# Altium project Design_Project_2.PrjPcb
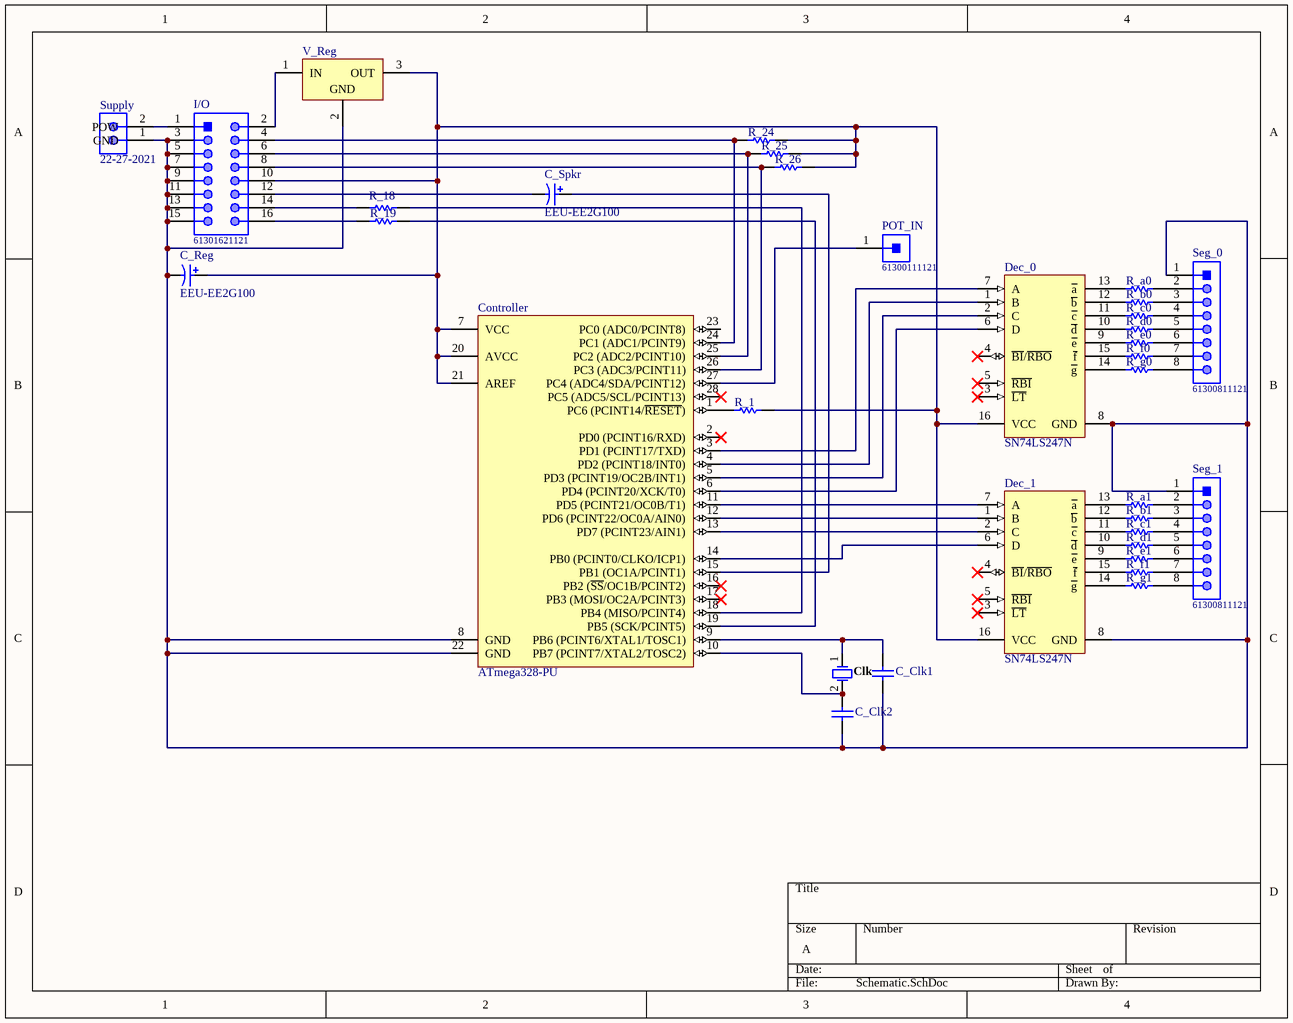
[diagram p0: Schematic.SchDoc]
1 sheet, 34 parts. Net scope: global (net labels, ports and power ports of the same name join across sheets).
Board file: PCB_Layout.PcbDoc

## Sheet Schematic.SchDoc
size A; SheetNumber: 1; SheetTotal: 1

### Parts
C_Clk1  C315C220K1G5TA  [KEMT-C315-THT-2]  (value not drawn)
C_Clk2  C315C220K1G5TA  [KEMT-C315-THT-2]  (value not drawn)
C_Reg  EEU-EE2G100  [PNSC-EEU-EE2G100-2_V]
C_Spkr  EEU-EE2G100  [PNSC-EEU-EE2G100-2_V]
Clk  FOXSLF/120-20  [FOX-FOXSLF-2_V]  (value not drawn)
Controller  ATmega328-PU  [28P3]
Dec_0  SN74LS247N  [N0016A]
Dec_1  SN74LS247N  [N0016A]
I/O  61301621121  [61301621121]
POT_IN  61300111121  [61300111121]
R_1  MFR-25FBF52-1K  [RESA60-630X240]  (value not drawn)
R_18  FR-25FF52-1K  [RESA60-630X240]  (value not drawn)
R_19  MFR-25FBF52-1K  [RESA60-630X240]  (value not drawn)
R_24  MFR-25FBF52-1K  [RESA60-630X240]  (value not drawn)
R_25  MFR-25FBF52-1K  [RESA60-630X240]  (value not drawn)
R_26  MFR-25FBF52-1K  [RESA60-630X240]  (value not drawn)
R_a0  MFR-25FBF52-1K  [RESA60-630X240]  (value not drawn)
R_a1  MFR-25FBF52-1K  [RESA60-630X240]  (value not drawn)
R_b0  MFR-25FBF52-1K  [RESA60-630X240]  (value not drawn)
R_b1  MFR-25FBF52-1K  [RESA60-630X240]  (value not drawn)
R_c0  MFR-25FBF52-1K  [RESA60-630X240]  (value not drawn)
R_c1  MFR-25FBF52-1K  [RESA60-630X240]  (value not drawn)
R_d0  MFR-25FBF52-1K  [RESA60-630X240]  (value not drawn)
R_d1  MFR-25FBF52-1K  [RESA60-630X240]  (value not drawn)
R_e0  MFR-25FBF52-1K  [RESA60-630X240]  (value not drawn)
R_e1  MFR-25FBF52-1K  [RESA60-630X240]  (value not drawn)
R_f0  MFR-25FBF52-1K  [RESA60-630X240]  (value not drawn)
R_f1  MFR-25FBF52-1K  [RESA60-630X240]  (value not drawn)
R_g0  MFR-25FBF52-1K  [RESA60-630X240]  (value not drawn)
R_g1  MFR-25FBF52-1K  [RESA60-630X240]  (value not drawn)
Seg_0  61300811121  [61300811121]
Seg_1  61300811121  [61300811121]
Supply  22-27-2021  [MOLX-22-27-2021_V]
V_Reg  LM7805CT  [FAIR-TO-220-3]  (value not drawn)

### Nets
NetC_Clk1_1: C_Clk1.1 C_Clk2.2 C_Reg.2 Controller.8(GND) Controller.22(GND) Dec_0.8(GND) Dec_1.8(GND) I/O.3 I/O.5 I/O.7 I/O.9 I/O.11 I/O.13 I/O.15 Seg_0.1 Seg_1.1 Supply.1(GND) V_Reg.2(GND)
NetC_Clk1_2: C_Clk1.2 Clk.1 Controller.9(PB6_(PCINT6/XTAL1/TOSC1))
NetC_Clk2_1: C_Clk2.1 Clk.2 Controller.10(PB7_(PCINT7/XTAL2/TOSC2))
NetC_Reg_1: C_Reg.1 Controller.7(VCC) Controller.20(AVCC) Controller.21(AREF) Dec_0.16(VCC) Dec_1.16(VCC) I/O.10 R_1.2 R_24.2 R_25.2 R_26.2 V_Reg.3(OUT)
NetC_Spkr_1: C_Spkr.1 Controller.15(PB1_(OC1A/PCINT1))
NetC_Spkr_2: C_Spkr.2 I/O.12
NetController_1: Controller.1(PC6_(PCINT14/~{RESET})) R_1.1
NetController_3: Controller.3(PD1_(PCINT17/TXD)) Dec_0.7(A)
NetController_4: Controller.4(PD2_(PCINT18/INT0)) Dec_0.1(B)
NetController_5: Controller.5(PD3_(PCINT19/OC2B/INT1)) Dec_0.2(C)
NetController_6: Controller.6(PD4_(PCINT20/XCK/T0)) Dec_0.6(D)
NetController_11: Controller.11(PD5_(PCINT21/OC0B/T1)) Dec_1.7(A)
NetController_12: Controller.12(PD6_(PCINT22/OC0A/AIN0)) Dec_1.1(B)
NetController_13: Controller.13(PD7_(PCINT23/AIN1)) Dec_1.2(C)
NetController_14: Controller.14(PB0_(PCINT0/CLKO/ICP1)) Dec_1.6(D)
NetController_18: Controller.18(PB4_(MISO/PCINT4)) R_18.2
NetController_19: Controller.19(PB5_(SCK/PCINT5)) R_19.2
NetController_24: Controller.24(PC1_(ADC1/PCINT9)) I/O.4 R_24.1
NetController_25: Controller.25(PC2_(ADC2/PCINT10)) I/O.6 R_25.1
NetController_26: Controller.26(PC3_(ADC3/PCINT11)) I/O.8 R_26.1
NetController_27: Controller.27(PC4_(ADC4/SDA/PCINT12)) POT_IN.1
NetDec_0_9: Dec_0.9(~{e}) R_e0.1
NetDec_0_10: Dec_0.10(~{d}) R_d0.1
NetDec_0_11: Dec_0.11(~{c}) R_c0.1
NetDec_0_12: Dec_0.12(~{b}) R_b0.1
NetDec_0_13: Dec_0.13(~{a}) R_a0.1
NetDec_0_14: Dec_0.14(~{g}) R_g0.1
NetDec_0_15: Dec_0.15(~{f}) R_f0.1
NetDec_1_9: Dec_1.9(~{e}) R_e1.1
NetDec_1_10: Dec_1.10(~{d}) R_d1.1
NetDec_1_11: Dec_1.11(~{c}) R_c1.1
NetDec_1_12: Dec_1.12(~{b}) R_b1.1
NetDec_1_13: Dec_1.13(~{a}) R_a1.1
NetDec_1_14: Dec_1.14(~{g}) R_g1.1
NetDec_1_15: Dec_1.15(~{f}) R_f1.1
NetI/O_1: I/O.1 Supply.2(POW)
NetI/O_2: I/O.2 V_Reg.1(IN)
NetI/O_14: I/O.14 R_18.1
NetI/O_16: I/O.16 R_19.1
NetR_a0_2: R_a0.2 Seg_0.2
NetR_a1_2: R_a1.2 Seg_1.2
NetR_b0_2: R_b0.2 Seg_0.3
NetR_b1_2: R_b1.2 Seg_1.3
NetR_c0_2: R_c0.2 Seg_0.4
NetR_c1_2: R_c1.2 Seg_1.4
NetR_d0_2: R_d0.2 Seg_0.5
NetR_d1_2: R_d1.2 Seg_1.5
NetR_e0_2: R_e0.2 Seg_0.6
NetR_e1_2: R_e1.2 Seg_1.6
NetR_f0_2: R_f0.2 Seg_0.7
NetR_f1_2: R_f1.2 Seg_1.7
NetR_g0_2: R_g0.2 Seg_0.8
NetR_g1_2: R_g1.2 Seg_1.8

Not connected (* = marked no-connect by the designer): Controller 2(PD0_(PCINT16/RXD))* 16(PB2_(~{SS}/OC1B/PCINT2))* 17(PB3_(MOSI/OC2A/PCINT3))* 23(PC0_(ADC0/PCINT8)) 28(PC5_(ADC5/SCL/PCINT13))*; Dec_0 3(~{LT})* 4(~{BI}/~{RBO})* 5(~{RBI})*; Dec_1 3(~{LT})* 4(~{BI}/~{RBO})* 5(~{RBI})*

### Library data of the parts
C_Clk1 C_Clk2 = CMP-1664-00008-1: Capacitor, Ceramic, 22 pF, +/-10 %, 100 V, -55 to 125 degC, 2-Pin THD, RoHS, Bulk; Max Input Voltage: 40 V; Min Input Voltage: 4.2 V; Output Current: 1.5 A; Output Voltage: 1.2 V; Outputs: 1; Case\Package: TO-220; RoHSCompliant: true; Min Operating Temperature: 0 degC; Max Operating Temperature: 125 degC; Package Quantity: 50; ComponentLink2URL: http://capacitoredge.kemet.com/capedge2/DataSheet/Datasheet-C315C220K1G5TA.pdf?pn=C315C220K1G5TA{BULK}; Radiation Hardening: No; Pins: 3; Length: 10.28 mm; ComponentLink1URL: http://www.kemet.com/; ComponentLink2Description: Datasheet; Height: 9.28 mm; REACH SVHC: No SVHC; ComponentLink1Description: Manufacturer URL; Max Ouput Current: 1.5 A; Weight: 0.08113 oz; Packaging: Rail/Tube; DatasheetVersion: Aug-16; Mount: Through Hole; PackageReference: C315-THT-2; Width: 4.82 mm; PackageDescription: 2-Pin Through Hole Device, Body 3.81 x 2.54 mm
C_Reg C_Spkr = CMP-0736-00002-1: Aluminum Electrolytic Capacitor, 10 uF +/- 20%, 400 V, -25 to 105 degC, 2-Pin 10 x 10 x 22 mm Through-hole, RoHS, Tape and Reel; Manufacturer: Panasonic; Ripple Current: 430 mA; Rated Voltage: 400 V; Cap.: 10 uF; Capacitance Tolerance: +/- 20%; ComponentLink2URL: http://industrial.panasonic.com/www-data/pdf/ABA0000/ABA0000CE113.pdf; Mounting Technology: Through Hole; PackageVersion: Nov-12; ComponentLink3URL: http://industrial.panasonic.com/www-data/pdf/ABA0000/ABA0000PE245.pdf; ComponentLink2Description: Datasheet; PartNumber: EEU-EE2G100; DatasheetVersion: Nov-12; PackageDescription: 2-Pin Through-hole, Base 10 x 10 mm, Height 22 mm; PackageReference: EEU-EE2G100-2; ComponentLink1URL: http://industrial.panasonic.com/; Temp. Range: -25 to 105 degC; RoHS: TRUE; Packing: Tape and Reel; ComponentLink1Description: Manufacturer URL; ComponentLink3Description: Package Specification
Clk = CMP-1749-00004-1: Resistance Weld Thru-Hole Crystal, 12 MHz, +/-30 ppm, -20 to 70 degC, 2-Pin THD, RoHS, Bulk; Elements: 1; Rds On Max: 115 mohm; Typical Rise Time: 90 ns; Max Power Dissipation: 2.5 W; Case\Package: TO-251-3; Input Capacitance: 350 pF; REACH SVHC: No SVHC; Length: 6.6 mm; ComponentLink1URL: http://www.foxonline.com/; PackageDescription: 2-Pin Through Hole Device, Body 11.35 x 4.65 mm, Pitch 4.88 mm; Radiation Hardening: No; Package Quantity: 70; Packaging: Rail/Tube; ComponentLink1Description: Manufacturer URL; Min Operating Temperature: -55 degC; Max Operating Temperature: 150 degC; RoHSCompliant: true; PackageReference: FOXSLF-2; DatasheetVersion: Mar-15; Pins: 3; Height: 6.1 mm; Mount: Through Hole; ComponentLink2URL: http://www.foxonline.com/pdfs/hc49slf.pdf; ComponentLink2Description: Datasheet; Width: 2.3 mm
Controller = CMP-0095-00015-2: 8-bit AVR Microcontroller, 32KB Flash, 1KB EEPROM, 2KB SRAM, 28-pin PDIP, Industrial Grade (-40°C to 85°C); ComponentLink3Description: ATmega48A/48PA/88A/88PA/168A/168PA/328/328P Summary; RevisionNote: DatasheetVersion updated. URLs added.; DatasheetVersion: revD, May-2011; ComponentLink1URL: http://www.atmel.com/; PackageVersion: revB, Sep-2001; PackageDescription: 28-lead (0.300"/7.62mm Wide) Plastic Dual Inline Package (PDIP); PackageReference: 28P3; ComponentLink1Description: Manufacturer URL; ComponentLink2Description: ATmega48A/48PA/88A/88PA/168A/168PA/328/328P Datasheet; ComponentLink3URL: http://www.atmel.com/dyn/resources/prod_documents/8271S.pdf; ComponentLink2URL: http://www.atmel.com/dyn/resources/prod_documents/8271.pdf
Dec_0 Dec_1 = CMP-0388-00310-2: BCD-to-7-Segment Decoder / Driver, 4.75 to 5.25 V, 0 to 70 degC, 16-pin DIP (N16), Pb-Free (RoHS); Manufacturer: Texas Instruments; SubFamily: Discrete Segment LED Driver; Vin(Max)(V): 5.25; Rating: Catalog; Vin(Min)(V): 4.75; PackageVersion: 4040049/E; DatasheetVersion: SDLS083; PackageDescription: 16-Pin Plastic In-Line, Body 19.305 x 6.35 mm, Pitch 2.54 mm; ComponentLink2URL: http://www.ti.com/general/docs/lit/getliterature.tsp?genericPartNumber=SN74LS247&fileType=pdf; PartNumber: SN74LS247N; Mounting Technology: Through Hole; ComponentLink2Description: Datasheet; ComponentLink3Description: Package Specification; PackageReference: N0016A; Code_JEDEC: MS-001; ComponentLink3URL: http://www.ti.com/litv/pdf/mpdi002c; Eco-Plan: Pb-Free (RoHS); ComponentLink1Description: Manufacturer URL; ComponentLink1URL: http://www.ti.com/
I/O = CMP-1502-01097-1: THT Vertical Pin Header WR-PHD, Pitch 2.54 mm, Dual Row, 16 pins; Manufacturer: Wurth Elektronik; Gender: Male; Rated Current: 3A; Pitch: 2.54mm; Withstanding Voltage: 500VAC; Contact Resistance: 20mOhm; Working Voltage: 250VAC; Pin Number: 16; Mounting Technology: THT; Orientation: Vertical; Manufacturer URL: http://www.we-online.de; Row Number: Dual; Part Number: 61301621121; Datasheet URL: https://katalog.we-online.de/em/datasheet/6130xx21121.pdf; Packaging: Bag; Operating Temperature: -40to105degC; Publisher: WurthElektronik; Package Reference: 61301621121
POT_IN = CMP-1502-01058-1: THT Vertical Pin Header WR-PHD, Pitch 2.54 mm, Single Row, 1 pins; Manufacturer: Wurth Elektronik; Gender: Male; Working Voltage: 250VAC; Withstanding Voltage: 500VAC; Pin Number: 1; Contact Resistance: 20mOhm; Rated Current: 3A; Pitch: 2.54mm; Mounting Technology: THT; Datasheet URL: https://katalog.we-online.de/em/datasheet/6130xx11121.pdf; Manufacturer URL: http://www.we-online.de; Operating Temperature: -40to105degC; Publisher: WurthElektronik; Part Number: 61300111121; Row Number: Single; Package Reference: 61300111121; Orientation: Vertical; Packaging: Bag
R_1 R_18 R_19 R_24-R_26 R_a0 R_a1 R_b0 R_b1 R_c0 R_c1 R_d0 R_d1 R_e0 R_e1 R_f0 R_f1 R_g0 R_g1 = CMP-1659-00075-1: Axial Resistor, 1 KOhm, +/- 1%, 250 mW, -55 to 155 degC, 2-Pin THD, RoHS, Bulk; Voltage Rating: 250 V; Resistance: 10 kohm; Power Rating: 250 mW; ComponentLink2Description: Datasheet; RoHSCompliant: true; PackageReference: MFR-25; Case\Package: Axial; Max Operating Temperature: 155 degC; DatasheetVersion: Apr-13; Tolerance: 1%; ComponentLink1URL: http://www.yageo.com/; Length: 0.248 inch; ComponentLink2URL: http://www.yageo.com/documents/recent/Yageo%20LR_MFR_2013.pdf; Packaging: Bulk; Package Quantity: 200; PackageDescription: 2-Pin Axial Lead, Dia 2.4 mm, Body Length 6.3 mm; Min Operating Temperature: -55 degC; ComponentLink1Description: Manufacturer URL
Seg_0 Seg_1 = CMP-1502-01076-1: THT Vertical Pin Header WR-PHD, Pitch 2.54 mm, Single Row, 8 pins; Manufacturer: Wurth Elektronik; Rated Current: 3A; Pin Number: 8; Working Voltage: 250VAC; Gender: Male; Contact Resistance: 20mOhm; Pitch: 2.54mm; Withstanding Voltage: 500VAC; Publisher: WurthElektronik; Operating Temperature: -40to105degC; Orientation: Vertical; Row Number: Single; Part Number: 61300811121; Package Reference: 61300811121; Mounting Technology: THT; Packaging: Bag; Manufacturer URL: http://www.we-online.de; Datasheet URL: https://katalog.we-online.de/em/datasheet/6130xx11121.pdf
Supply = CMP-2000-05537-1: Male Header, Pitch 2.54 mm, 1 x 2 Position, Height 11.7 mm, Tail Length 3.56 mm, 0 to 75 degC, RoHS, Bulk; Manufacturer: Molex; PartNumber: 0022272021; Current rating: 4A; Package Version: Rev. BC, 02/2012; Voltage rating: 250V; No. of Positions: 2; Pitch: 2.54mm; No. of Rows: 1; Orientation: Vertical; Operating temperature: 0°Cto+75°C; Manufacturer URL: http://www.molex.com/; Mounting Technology: ThroughHole; Housing material: Nylon(UL94V-0); Package Description: 2-Leads Header, Body 5.08 x 5.8 mm, Pitch 2.54 mm; Voltage - Max: 250V; Datasheet URL: http://www.molex.com/pdm_docs/sd/022272021_sd.pdf; Package Reference: 22-27-2021; Contact material: Tinplatedbrass; Current - Max: 4A; Datasheet Version: Rev. F, 06/2009
V_Reg = CMP-2000-04938-1: Positive Voltage Regulator, 5 V, 1 A, -40 to 125 degC, 3-Pin TO-220, RoHS, Tube; Manufacturer: FairchildSemiconductor; Maximum Input Voltage: 35V; Maximum Quiescent Current: 8mA; Load Regulation: 100mV; Maximum Output Current: 2.2(Typ)A; Output Type: Fixed; Typical Dropout Voltage @ Current: 2@1AV; Rad Hard: No; Output Voltage: 5V; Accuracy: ±4%; Number of Outputs: 1; Category: LinearRegulator; Package Description: 3-Pin Through Hole Device, Body 10 x 4.5 mm, Pitch 2.54 mm; Packaging: Rail/Tube; Mounting: ThroughHole; Polarity: Positive; Manufacturer URL: https://www.fairchildsemi.com/; Line Regulation: 100mV; Datasheet Version: Aug-12; Datasheet URL: https://datasheet.ciiva.com/26904/lm7805ct-26904988.pdf; Package Reference: TO-220; Package URL: https://www.fairchildsemi.com/package-drawings/TO/TO220B03.pdf; Package: 3TO-220AB; Operating Temperature: -40to125degC; Type: Linear